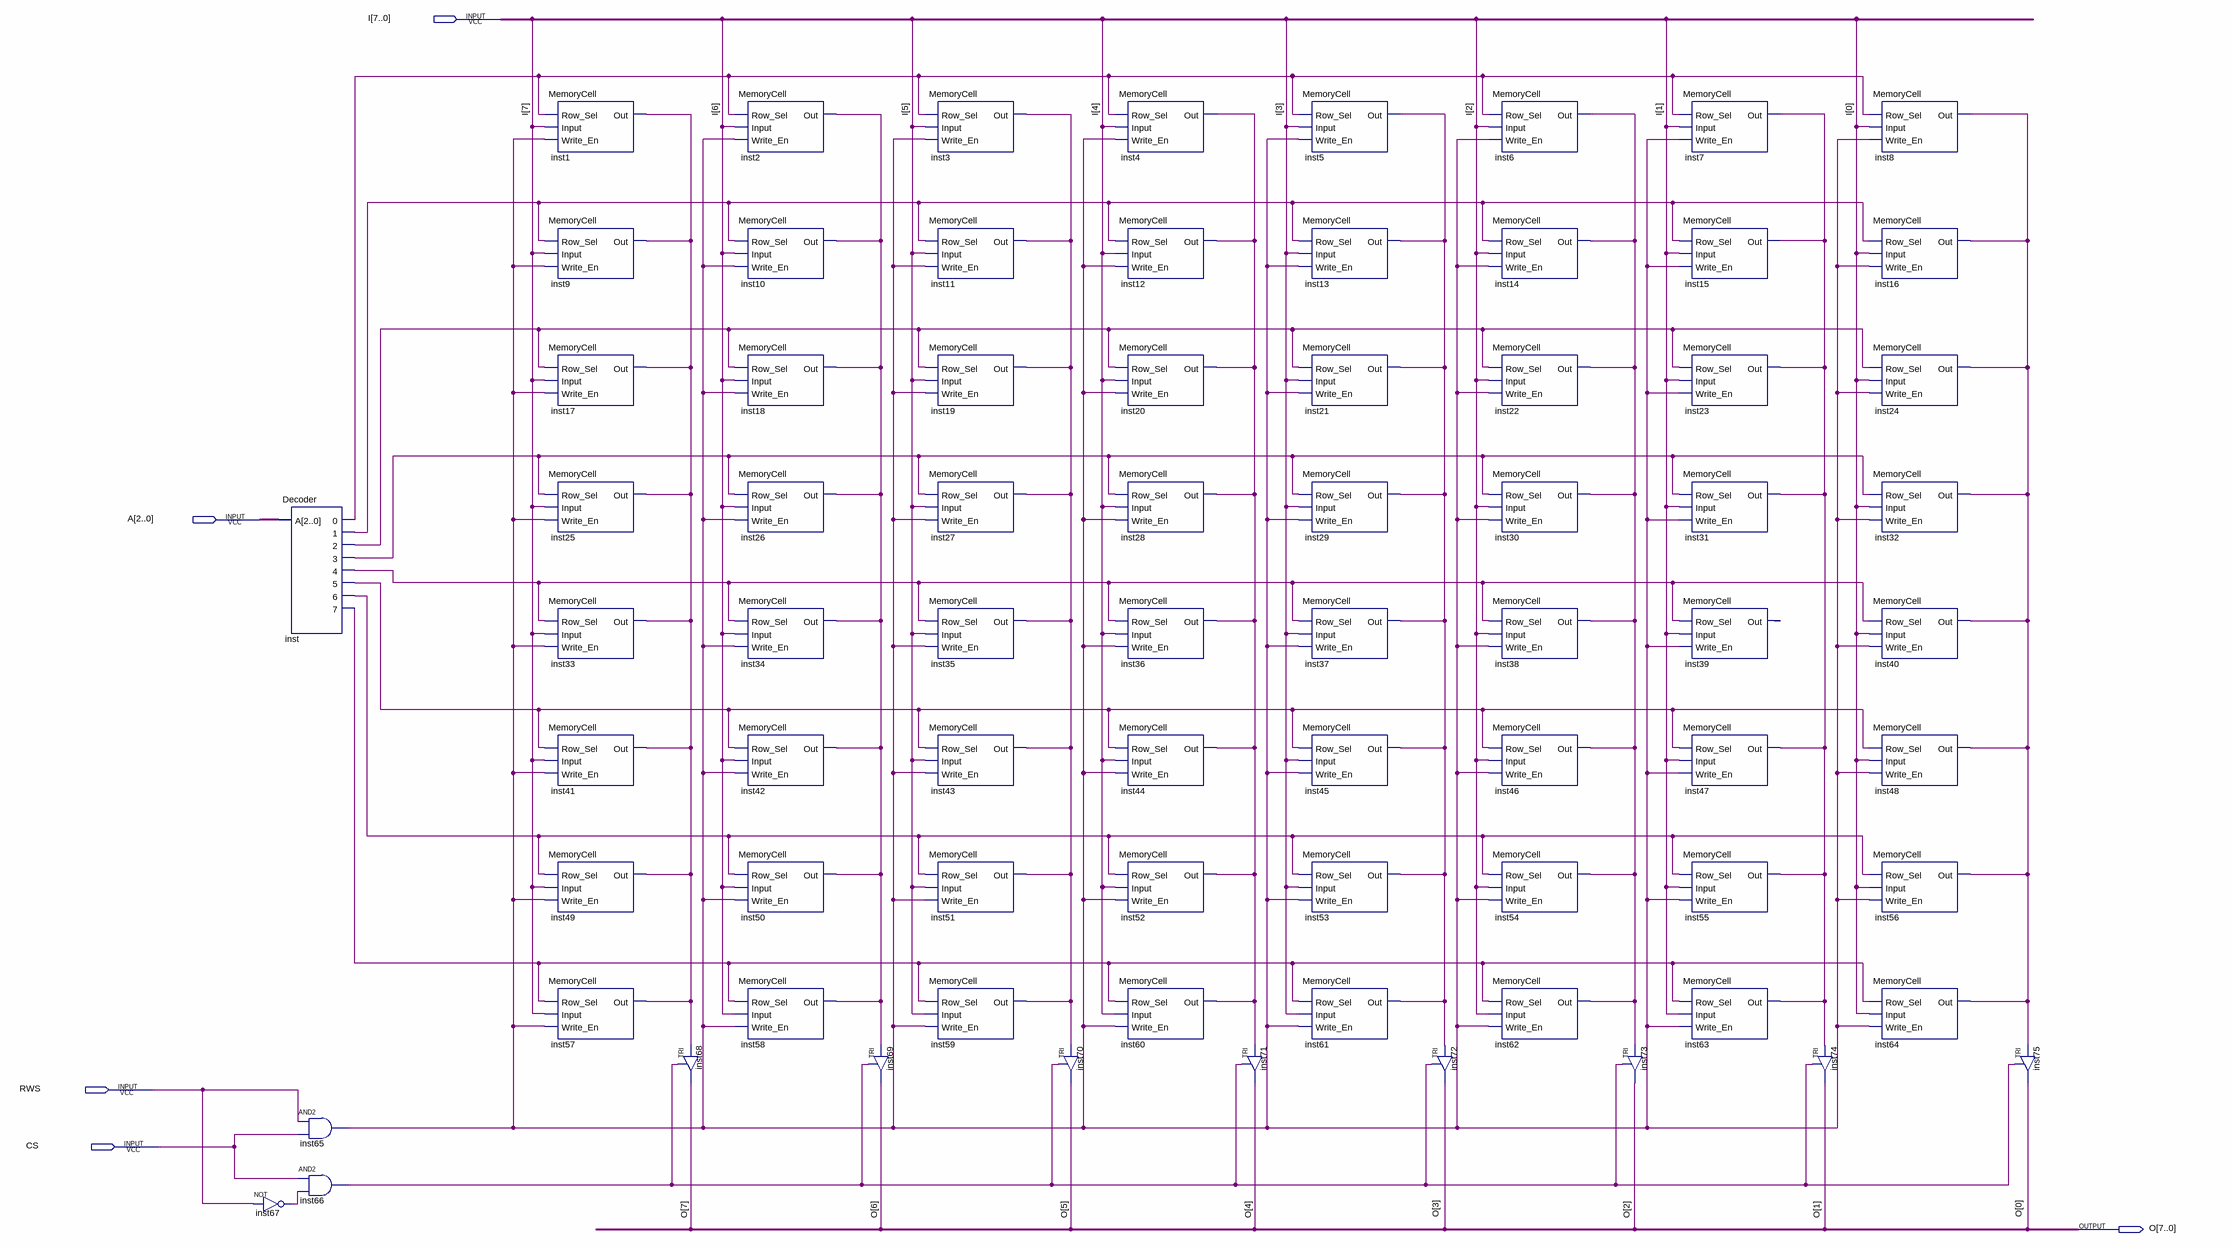
[diagram p0: schematic sheet]
// Quartus schematic 8x8_RAM.bdf as structural Verilog: 76 symbols, 5 pins
module \8x8_RAM  (
  input  [7:0] I,
  input  [2:0] A,
  input  RWS,
  input  CS,
  output [7:0] O
);

  wire inst1_out, inst2_out, inst3_out, inst4_out, inst5_out, inst6_out, inst7_out, inst8_out, inst39_out,
       inst65_out, inst66_out, inst67_out, inst_0, inst_1, inst_2, inst_3, inst_4, inst_5, inst_6, inst_7;

  not inst67 (inst67_out, RWS);
  Decoder inst (
    .A(A), .\0 (inst_0), .\1 (inst_1), .\2 (inst_2), .\3 (inst_3), .\4 (inst_4), .\5 (inst_5), .\6 (inst_6),
    .\7 (inst_7));
  and inst65 (inst65_out, RWS, CS);
  and inst66 (inst66_out, CS, inst67_out);
  MemoryCell inst1 (.Row_Sel(inst_0), .Input(I[7]), .Write_En(inst65_out), .Out(inst1_out));
  MemoryCell inst9 (.Row_Sel(inst_1), .Input(I[7]), .Write_En(inst65_out), .Out(inst1_out));
  MemoryCell inst17 (.Row_Sel(inst_2), .Input(I[7]), .Write_En(inst65_out), .Out(inst1_out));
  MemoryCell inst25 (.Row_Sel(inst_3), .Input(I[7]), .Write_En(inst65_out), .Out(inst1_out));
  MemoryCell inst33 (.Row_Sel(inst_4), .Input(I[7]), .Write_En(inst65_out), .Out(inst1_out));
  MemoryCell inst41 (.Row_Sel(inst_5), .Input(I[7]), .Write_En(inst65_out), .Out(inst1_out));
  MemoryCell inst49 (.Row_Sel(inst_6), .Input(I[7]), .Write_En(inst65_out), .Out(inst1_out));
  MemoryCell inst57 (.Row_Sel(inst_7), .Input(I[7]), .Write_En(inst65_out), .Out(inst1_out));
  TRI inst68 (.IN(inst1_out), .OE(inst66_out), .OUT(O[7]));
  MemoryCell inst2 (.Row_Sel(inst_0), .Input(I[6]), .Write_En(inst65_out), .Out(inst2_out));
  MemoryCell inst10 (.Row_Sel(inst_1), .Input(I[6]), .Write_En(inst65_out), .Out(inst2_out));
  MemoryCell inst18 (.Row_Sel(inst_2), .Input(I[6]), .Write_En(inst65_out), .Out(inst2_out));
  MemoryCell inst26 (.Row_Sel(inst_3), .Input(I[6]), .Write_En(inst65_out), .Out(inst2_out));
  MemoryCell inst34 (.Row_Sel(inst_4), .Input(I[6]), .Write_En(inst65_out), .Out(inst2_out));
  MemoryCell inst42 (.Row_Sel(inst_5), .Input(I[6]), .Write_En(inst65_out), .Out(inst2_out));
  MemoryCell inst50 (.Row_Sel(inst_6), .Input(I[6]), .Write_En(inst65_out), .Out(inst2_out));
  MemoryCell inst58 (.Row_Sel(inst_7), .Input(I[6]), .Write_En(inst65_out), .Out(inst2_out));
  TRI inst69 (.IN(inst2_out), .OE(inst66_out), .OUT(O[6]));
  MemoryCell inst3 (.Row_Sel(inst_0), .Input(I[5]), .Write_En(inst65_out), .Out(inst3_out));
  MemoryCell inst11 (.Row_Sel(inst_1), .Input(I[5]), .Write_En(inst65_out), .Out(inst3_out));
  MemoryCell inst19 (.Row_Sel(inst_2), .Input(I[5]), .Write_En(inst65_out), .Out(inst3_out));
  MemoryCell inst27 (.Row_Sel(inst_3), .Input(I[5]), .Write_En(inst65_out), .Out(inst3_out));
  MemoryCell inst35 (.Row_Sel(inst_4), .Input(I[5]), .Write_En(inst65_out), .Out(inst3_out));
  MemoryCell inst43 (.Row_Sel(inst_5), .Input(I[5]), .Write_En(inst65_out), .Out(inst3_out));
  MemoryCell inst51 (.Row_Sel(inst_6), .Input(I[5]), .Write_En(inst65_out), .Out(inst3_out));
  MemoryCell inst59 (.Row_Sel(inst_7), .Input(I[5]), .Write_En(inst65_out), .Out(inst3_out));
  TRI inst70 (.IN(inst3_out), .OE(inst66_out), .OUT(O[5]));
  MemoryCell inst4 (.Row_Sel(inst_0), .Input(I[4]), .Write_En(inst65_out), .Out(inst4_out));
  MemoryCell inst12 (.Row_Sel(inst_1), .Input(I[4]), .Write_En(inst65_out), .Out(inst4_out));
  MemoryCell inst20 (.Row_Sel(inst_2), .Input(I[4]), .Write_En(inst65_out), .Out(inst4_out));
  MemoryCell inst28 (.Row_Sel(inst_3), .Input(I[4]), .Write_En(inst65_out), .Out(inst4_out));
  MemoryCell inst36 (.Row_Sel(inst_4), .Input(I[4]), .Write_En(inst65_out), .Out(inst4_out));
  MemoryCell inst44 (.Row_Sel(inst_5), .Input(I[4]), .Write_En(inst65_out), .Out(inst4_out));
  MemoryCell inst52 (.Row_Sel(inst_6), .Input(I[4]), .Write_En(inst65_out), .Out(inst4_out));
  MemoryCell inst60 (.Row_Sel(inst_7), .Input(I[4]), .Write_En(inst65_out), .Out(inst4_out));
  TRI inst71 (.IN(inst4_out), .OE(inst66_out), .OUT(O[4]));
  MemoryCell inst5 (.Row_Sel(inst_0), .Input(I[3]), .Write_En(inst65_out), .Out(inst5_out));
  MemoryCell inst13 (.Row_Sel(inst_1), .Input(I[3]), .Write_En(inst65_out), .Out(inst5_out));
  MemoryCell inst21 (.Row_Sel(inst_2), .Input(I[3]), .Write_En(inst65_out), .Out(inst5_out));
  MemoryCell inst29 (.Row_Sel(inst_3), .Input(I[3]), .Write_En(inst65_out), .Out(inst5_out));
  MemoryCell inst37 (.Row_Sel(inst_4), .Input(I[3]), .Write_En(inst65_out), .Out(inst5_out));
  MemoryCell inst45 (.Row_Sel(inst_5), .Input(I[3]), .Write_En(inst65_out), .Out(inst5_out));
  MemoryCell inst53 (.Row_Sel(inst_6), .Input(I[3]), .Write_En(inst65_out), .Out(inst5_out));
  MemoryCell inst61 (.Row_Sel(inst_7), .Input(I[3]), .Write_En(inst65_out), .Out(inst5_out));
  TRI inst72 (.IN(inst5_out), .OE(inst66_out), .OUT(O[3]));
  MemoryCell inst6 (.Row_Sel(inst_0), .Input(I[2]), .Write_En(inst65_out), .Out(inst6_out));
  MemoryCell inst14 (.Row_Sel(inst_1), .Input(I[2]), .Write_En(inst65_out), .Out(inst6_out));
  MemoryCell inst22 (.Row_Sel(inst_2), .Input(I[2]), .Write_En(inst65_out), .Out(inst6_out));
  MemoryCell inst30 (.Row_Sel(inst_3), .Input(I[2]), .Write_En(inst65_out), .Out(inst6_out));
  MemoryCell inst38 (.Row_Sel(inst_4), .Input(I[2]), .Write_En(inst65_out), .Out(inst6_out));
  MemoryCell inst46 (.Row_Sel(inst_5), .Input(I[2]), .Write_En(inst65_out), .Out(inst6_out));
  MemoryCell inst54 (.Row_Sel(inst_6), .Input(I[2]), .Write_En(inst65_out), .Out(inst6_out));
  MemoryCell inst62 (.Row_Sel(inst_7), .Input(I[2]), .Write_En(inst65_out), .Out(inst6_out));
  TRI inst73 (.IN(inst6_out), .OE(inst66_out), .OUT(O[2]));
  MemoryCell inst7 (.Row_Sel(inst_0), .Input(I[1]), .Write_En(inst65_out), .Out(inst7_out));
  MemoryCell inst15 (.Row_Sel(inst_1), .Input(I[1]), .Write_En(inst65_out), .Out(inst7_out));
  MemoryCell inst23 (.Row_Sel(inst_2), .Input(I[1]), .Write_En(inst65_out), .Out(inst7_out));
  MemoryCell inst31 (.Row_Sel(inst_3), .Input(I[1]), .Write_En(inst65_out), .Out(inst7_out));
  MemoryCell inst39 (.Row_Sel(inst_4), .Input(I[1]), .Write_En(inst65_out), .Out(inst39_out));
  MemoryCell inst47 (.Row_Sel(inst_5), .Input(I[1]), .Write_En(inst65_out), .Out(inst7_out));
  MemoryCell inst55 (.Row_Sel(inst_6), .Input(I[1]), .Write_En(inst65_out), .Out(inst7_out));
  MemoryCell inst63 (.Row_Sel(inst_7), .Input(I[1]), .Write_En(inst65_out), .Out(inst7_out));
  TRI inst74 (.IN(inst7_out), .OE(inst66_out), .OUT(O[1]));
  MemoryCell inst8 (.Row_Sel(inst_0), .Input(I[0]), .Write_En(inst65_out), .Out(inst8_out));
  MemoryCell inst16 (.Row_Sel(inst_1), .Input(I[0]), .Write_En(inst65_out), .Out(inst8_out));
  MemoryCell inst24 (.Row_Sel(inst_2), .Input(I[0]), .Write_En(inst65_out), .Out(inst8_out));
  MemoryCell inst32 (.Row_Sel(inst_3), .Input(I[0]), .Write_En(inst65_out), .Out(inst8_out));
  MemoryCell inst40 (.Row_Sel(inst_4), .Input(I[0]), .Write_En(inst65_out), .Out(inst8_out));
  MemoryCell inst48 (.Row_Sel(inst_5), .Input(I[0]), .Write_En(inst65_out), .Out(inst8_out));
  MemoryCell inst56 (.Row_Sel(inst_6), .Input(I[0]), .Write_En(inst65_out), .Out(inst8_out));
  MemoryCell inst64 (.Row_Sel(inst_7), .Input(I[0]), .Write_En(inst65_out), .Out(inst8_out));
  TRI inst75 (.IN(inst8_out), .OE(inst66_out), .OUT(O[0]));
endmodule
